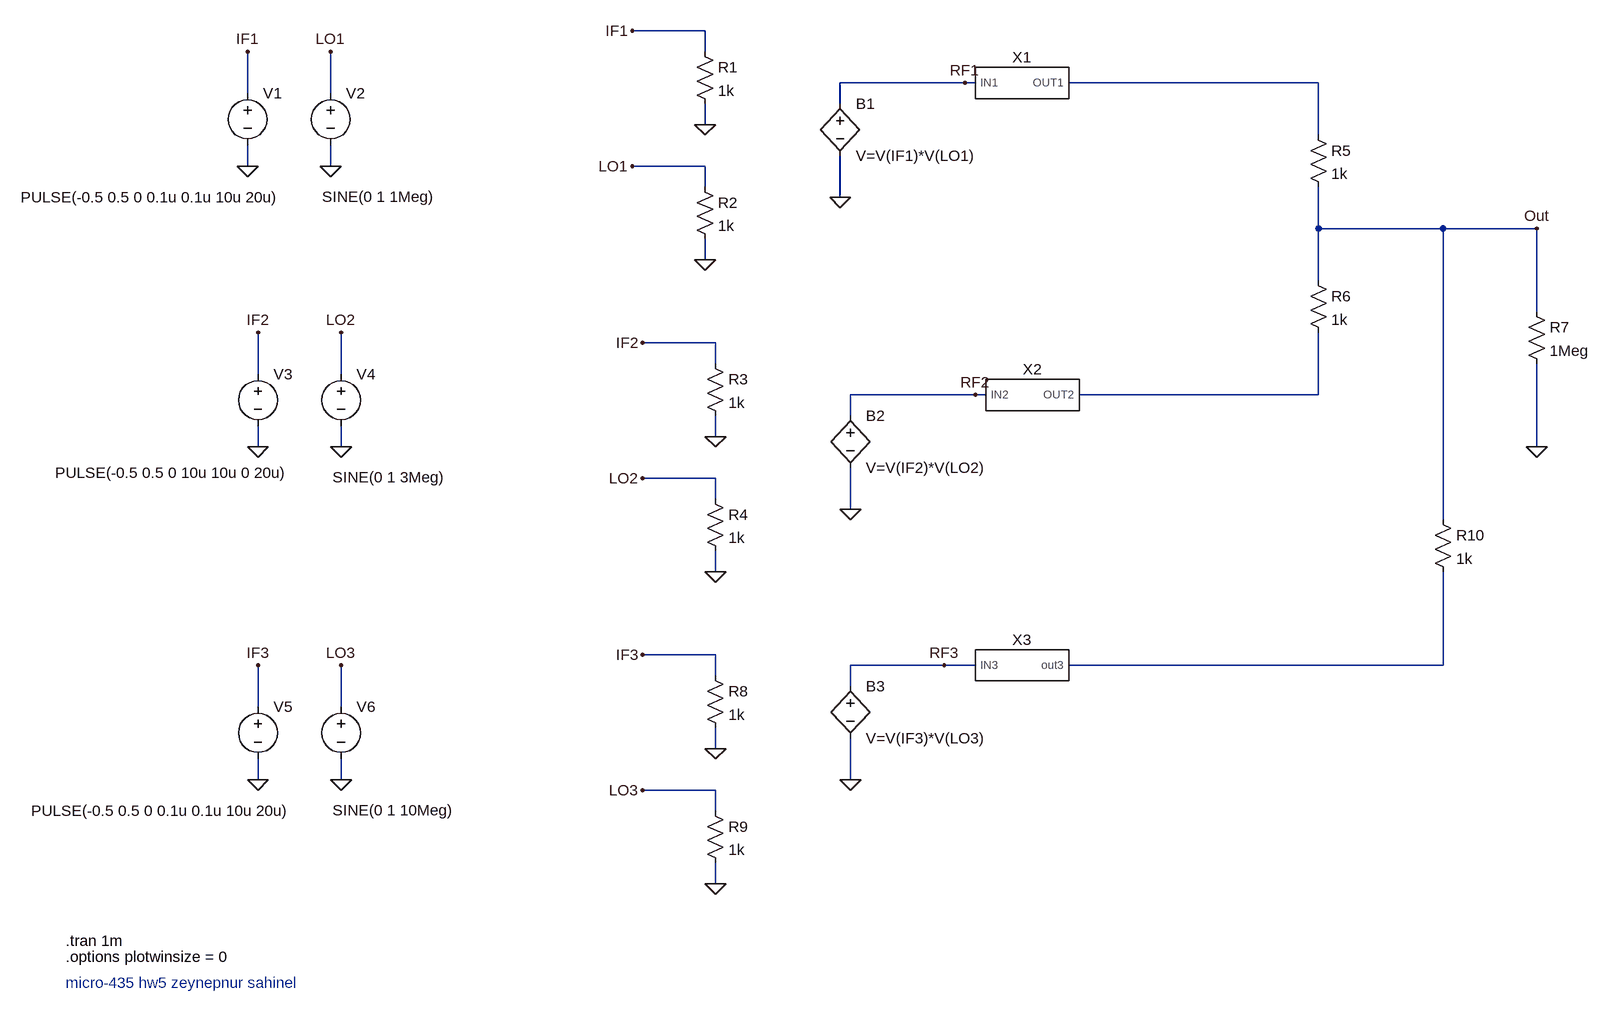
[diagram p0: schematic control3_wblocks.asc]
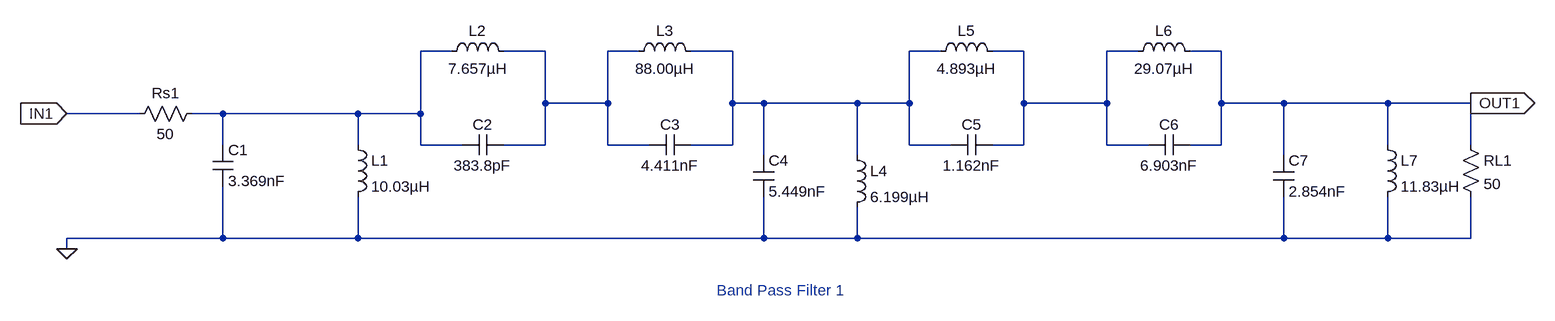
[diagram p1: sub-circuit bpf1.asc]
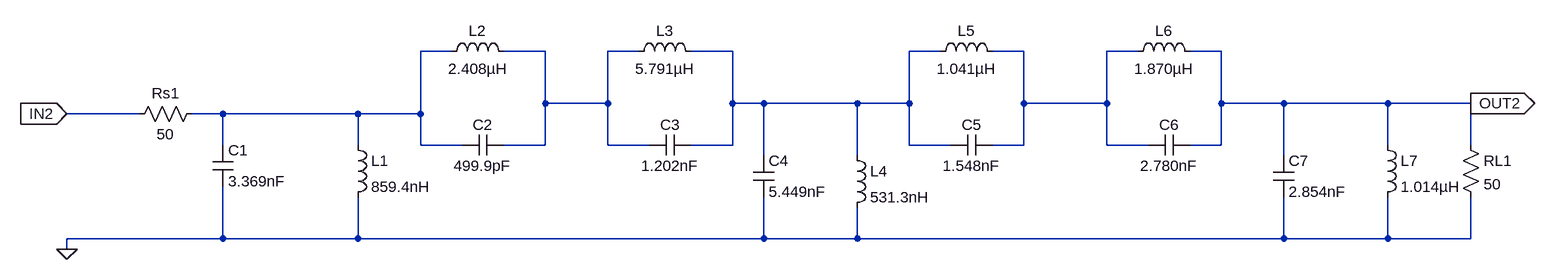
[diagram p2: sub-circuit bpf2.asc]
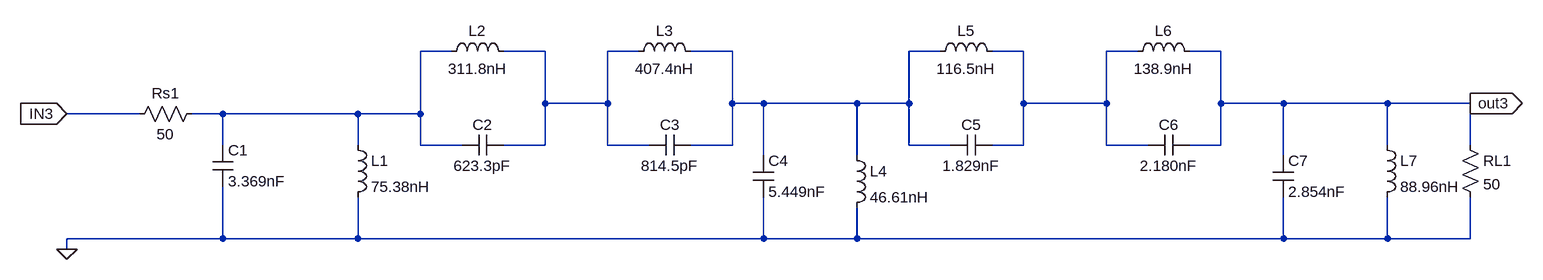
[diagram p3: sub-circuit bpf3.asc]
control3_wblocks.asc, the LTspice schematic file:
Version 4
SHEET 1 2360 840
WIRE -1328 -640 -1440 -640
WIRE -1328 -608 -1328 -640
WIRE -928 -560 -1120 -560
WIRE -912 -560 -928 -560
WIRE -384 -560 -768 -560
WIRE -2032 -544 -2032 -608
WIRE -1904 -544 -1904 -608
WIRE -1120 -528 -1120 -560
WIRE -1328 -496 -1328 -528
WIRE -384 -480 -384 -560
WIRE -2032 -432 -2032 -464
WIRE -1904 -432 -1904 -464
WIRE -1328 -432 -1440 -432
WIRE -1328 -400 -1328 -432
WIRE -1120 -384 -1120 -448
WIRE -384 -336 -384 -400
WIRE -192 -336 -384 -336
WIRE -48 -336 -192 -336
WIRE -1328 -288 -1328 -320
WIRE -384 -256 -384 -336
WIRE -48 -208 -48 -336
WIRE -1312 -160 -1424 -160
WIRE -1312 -128 -1312 -160
WIRE -2016 -112 -2016 -176
WIRE -1888 -112 -1888 -176
WIRE -912 -80 -1104 -80
WIRE -896 -80 -912 -80
WIRE -384 -80 -384 -176
WIRE -384 -80 -752 -80
WIRE -1104 -48 -1104 -80
WIRE -1312 -16 -1312 -48
WIRE -2016 0 -2016 -32
WIRE -1888 0 -1888 -32
WIRE -48 0 -48 -128
WIRE -1312 48 -1424 48
WIRE -1312 80 -1312 48
WIRE -1104 96 -1104 32
WIRE -192 112 -192 -336
WIRE -1312 192 -1312 160
WIRE -1312 320 -1424 320
WIRE -960 336 -1104 336
WIRE -912 336 -960 336
WIRE -192 336 -192 192
WIRE -192 336 -768 336
WIRE -1312 352 -1312 320
WIRE -1104 368 -1104 336
WIRE -2016 400 -2016 336
WIRE -1888 400 -1888 336
WIRE -1312 464 -1312 432
WIRE -2016 512 -2016 480
WIRE -1888 512 -1888 480
WIRE -1104 512 -1104 448
WIRE -1312 528 -1424 528
WIRE -1312 560 -1312 528
WIRE -1312 672 -1312 640
FLAG -1328 -496 0
FLAG -1440 -640 IF1
FLAG -1328 -288 0
FLAG -1440 -432 LO1
FLAG -1120 -384 0
FLAG -928 -560 RF1
FLAG -2032 -432 0
FLAG -1904 -432 0
FLAG -2032 -608 IF1
FLAG -1904 -608 LO1
FLAG -1312 -16 0
FLAG -1424 -160 IF2
FLAG -1312 192 0
FLAG -1424 48 LO2
FLAG -1104 96 0
FLAG -912 -80 RF2
FLAG -2016 0 0
FLAG -1888 0 0
FLAG -2016 -176 IF2
FLAG -1888 -176 LO2
FLAG -48 0 0
FLAG -48 -336 Out
FLAG -1312 464 0
FLAG -1424 320 IF3
FLAG -1312 672 0
FLAG -1424 528 LO3
FLAG -1104 512 0
FLAG -960 336 RF3
FLAG -2016 512 0
FLAG -1888 512 0
FLAG -2016 336 IF3
FLAG -1888 336 LO3
SYMBOL bv -1120 -544 R0
SYMATTR InstName B1
SYMATTR Value V=V(IF1)*V(LO1)
SYMBOL res -1344 -624 R0
SYMATTR InstName R1
SYMATTR Value 1k
SYMBOL res -1344 -416 R0
SYMATTR InstName R2
SYMATTR Value 1k
SYMBOL voltage -2032 -560 R0
WINDOW 3 -349 176 Left 2
WINDOW 123 0 0 Left 0
WINDOW 39 0 0 Left 0
SYMATTR Value PULSE(-0.5 0.5 0 0.1u 0.1u 10u 20u)
SYMATTR InstName V1
SYMBOL voltage -1904 -560 R0
WINDOW 3 -13 175 Left 2
WINDOW 123 0 0 Left 0
WINDOW 39 0 0 Left 0
SYMATTR Value SINE(0 1 1Meg)
SYMATTR InstName V2
SYMBOL bv -1104 -64 R0
SYMATTR InstName B2
SYMATTR Value V=V(IF2)*V(LO2)
SYMBOL res -1328 -144 R0
SYMATTR InstName R3
SYMATTR Value 1k
SYMBOL res -1328 64 R0
SYMATTR InstName R4
SYMATTR Value 1k
SYMBOL voltage -2016 -128 R0
WINDOW 3 -312 168 Left 2
WINDOW 123 0 0 Left 0
WINDOW 39 0 0 Left 0
SYMATTR Value PULSE(-0.5 0.5 0 10u 10u 0 20u)
SYMATTR InstName V3
SYMBOL voltage -1888 -128 R0
WINDOW 3 -13 175 Left 2
WINDOW 123 0 0 Left 0
WINDOW 39 0 0 Left 0
SYMATTR Value SINE(0 1 3Meg)
SYMATTR InstName V4
SYMBOL res -400 -496 R0
SYMATTR InstName R5
SYMATTR Value 1k
SYMBOL res -400 -272 R0
SYMATTR InstName R6
SYMATTR Value 1k
SYMBOL res -64 -224 R0
SYMATTR InstName R7
SYMATTR Value 1Meg
SYMBOL bv -1104 352 R0
SYMATTR InstName B3
SYMATTR Value V=V(IF3)*V(LO3)
SYMBOL res -1328 336 R0
SYMATTR InstName R8
SYMATTR Value 1k
SYMBOL res -1328 544 R0
SYMATTR InstName R9
SYMATTR Value 1k
SYMBOL voltage -2016 384 R0
WINDOW 3 -349 176 Left 2
WINDOW 123 0 0 Left 0
WINDOW 39 0 0 Left 0
SYMATTR Value PULSE(-0.5 0.5 0 0.1u 0.1u 10u 20u)
SYMATTR InstName V5
SYMBOL voltage -1888 384 R0
WINDOW 3 -13 175 Left 2
WINDOW 123 0 0 Left 0
WINDOW 39 0 0 Left 0
SYMATTR Value SINE(0 1 10Meg)
SYMATTR InstName V6
SYMBOL res -208 96 R0
SYMATTR InstName R10
SYMATTR Value 1k
SYMBOL BPF1 -848 -560 R0
SYMATTR InstName X1
SYMBOL BPF2 -832 -80 R0
SYMATTR InstName X2
SYMBOL BPF3 -848 336 R0
SYMATTR InstName X3
TEXT -2312 824 Left 2 ;micro-435 hw5 zeynepnur sahinel
TEXT -2312 760 Left 2 !.tran 1m
TEXT -2312 784 Left 2 !.options plotwinsize = 0

bpf1.asc, the sub-circuit schematic file:
Version 4
SHEET 1 1212 680
WIRE -480 48 -528 48
WIRE -336 48 -400 48
WIRE -192 48 -240 48
WIRE -48 48 -112 48
WIRE 272 48 224 48
WIRE 400 48 352 48
WIRE 576 48 528 48
WIRE 704 48 656 48
WIRE -336 128 -336 48
WIRE -240 128 -240 48
WIRE -240 128 -336 128
WIRE -48 128 -48 48
WIRE 0 128 -48 128
WIRE 144 128 0 128
WIRE 224 128 224 48
WIRE 224 128 144 128
WIRE 400 128 400 48
WIRE 528 128 528 48
WIRE 528 128 400 128
WIRE 704 128 704 48
WIRE 800 128 704 128
WIRE 960 128 800 128
WIRE 1088 128 960 128
WIRE -960 144 -1072 144
WIRE -832 144 -880 144
WIRE -624 144 -832 144
WIRE -528 144 -528 48
WIRE -528 144 -624 144
WIRE -832 192 -832 144
WIRE -624 192 -624 144
WIRE -528 192 -528 144
WIRE -464 192 -528 192
WIRE -336 192 -336 128
WIRE -336 192 -400 192
WIRE -240 192 -240 128
WIRE -176 192 -240 192
WIRE -48 192 -48 128
WIRE -48 192 -112 192
WIRE 224 192 224 128
WIRE 288 192 224 192
WIRE 400 192 400 128
WIRE 400 192 352 192
WIRE 528 192 528 128
WIRE 592 192 528 192
WIRE 704 192 704 128
WIRE 704 192 656 192
WIRE 960 192 960 128
WIRE 1088 192 1088 128
WIRE 0 208 0 128
WIRE 144 208 144 128
WIRE 800 208 800 128
WIRE -832 336 -832 256
WIRE -832 336 -1072 336
WIRE -624 336 -624 272
WIRE -624 336 -832 336
WIRE 0 336 0 272
WIRE 0 336 -624 336
WIRE 144 336 144 288
WIRE 144 336 0 336
WIRE 800 336 800 272
WIRE 800 336 144 336
WIRE 960 336 960 272
WIRE 960 336 800 336
WIRE 1088 336 1088 272
WIRE 1088 336 960 336
WIRE -1072 352 -1072 336
FLAG -1072 352 0
FLAG 1088 128 OUT1
IOPIN 1088 128 Out
FLAG -1072 144 IN1
IOPIN -1072 144 In
SYMBOL res -864 128 R90
WINDOW 0 0 56 VBottom 2
WINDOW 3 32 56 VTop 2
SYMATTR InstName Rs1
SYMATTR Value 50
SYMBOL cap -848 192 R0
SYMATTR InstName C1
SYMATTR Value 3.369nF
SYMBOL ind -640 176 R0
SYMATTR InstName L1
SYMATTR Value 10.03µH
SYMBOL ind -496 64 R270
WINDOW 0 32 56 VTop 2
WINDOW 3 5 56 VBottom 2
SYMATTR InstName L2
SYMATTR Value 7.657µH
SYMBOL cap -400 176 R90
WINDOW 0 0 32 VBottom 2
WINDOW 3 32 32 VTop 2
SYMATTR InstName C2
SYMATTR Value 383.8pF
SYMBOL ind -208 64 R270
WINDOW 0 32 56 VTop 2
WINDOW 3 5 56 VBottom 2
SYMATTR InstName L3
SYMATTR Value 88.00µH
SYMBOL cap -176 208 R270
WINDOW 0 32 32 VTop 2
WINDOW 3 0 32 VBottom 2
SYMATTR InstName C3
SYMATTR Value 4.411nF
SYMBOL cap -16 208 R0
SYMATTR InstName C4
SYMATTR Value 5.449nF
SYMBOL ind 128 192 R0
SYMATTR InstName L4
SYMATTR Value 6.199µH
SYMBOL ind 256 64 R270
WINDOW 0 32 56 VTop 2
WINDOW 3 5 56 VBottom 2
SYMATTR InstName L5
SYMATTR Value 4.893µH
SYMBOL cap 352 176 R90
WINDOW 0 0 32 VBottom 2
WINDOW 3 32 32 VTop 2
SYMATTR InstName C5
SYMATTR Value 1.162nF
SYMBOL ind 560 64 R270
WINDOW 0 32 56 VTop 2
WINDOW 3 5 56 VBottom 2
SYMATTR InstName L6
SYMATTR Value 29.07µH
SYMBOL cap 592 208 R270
WINDOW 0 32 32 VTop 2
WINDOW 3 0 32 VBottom 2
SYMATTR InstName C6
SYMATTR Value 6.903nF
SYMBOL cap 784 208 R0
SYMATTR InstName C7
SYMATTR Value 2.854nF
SYMBOL ind 944 176 R0
SYMATTR InstName L7
SYMATTR Value 11.83µH
SYMBOL res 1072 176 R0
SYMATTR InstName RL1
SYMATTR Value 50
TEXT -72 416 Left 2 ;Band Pass Filter 1

bpf2.asc, the sub-circuit schematic file:
Version 4
SHEET 1 1388 680
WIRE -304 -48 -352 -48
WIRE -160 -48 -224 -48
WIRE -16 -48 -64 -48
WIRE 128 -48 64 -48
WIRE 448 -48 400 -48
WIRE 576 -48 528 -48
WIRE 752 -48 704 -48
WIRE 880 -48 832 -48
WIRE -160 32 -160 -48
WIRE -64 32 -64 -48
WIRE -64 32 -160 32
WIRE 128 32 128 -48
WIRE 176 32 128 32
WIRE 320 32 176 32
WIRE 400 32 400 -48
WIRE 400 32 320 32
WIRE 576 32 576 -48
WIRE 704 32 704 -48
WIRE 704 32 576 32
WIRE 880 32 880 -48
WIRE 976 32 880 32
WIRE 1136 32 976 32
WIRE 1264 32 1136 32
WIRE -784 48 -896 48
WIRE -656 48 -704 48
WIRE -448 48 -656 48
WIRE -352 48 -352 -48
WIRE -352 48 -448 48
WIRE -656 96 -656 48
WIRE -448 96 -448 48
WIRE -352 96 -352 48
WIRE -288 96 -352 96
WIRE -160 96 -160 32
WIRE -160 96 -224 96
WIRE -64 96 -64 32
WIRE 0 96 -64 96
WIRE 128 96 128 32
WIRE 128 96 64 96
WIRE 400 96 400 32
WIRE 464 96 400 96
WIRE 576 96 576 32
WIRE 576 96 528 96
WIRE 704 96 704 32
WIRE 768 96 704 96
WIRE 880 96 880 32
WIRE 880 96 832 96
WIRE 1136 96 1136 32
WIRE 1264 96 1264 32
WIRE 176 112 176 32
WIRE 320 112 320 32
WIRE 976 112 976 32
WIRE -656 240 -656 160
WIRE -656 240 -896 240
WIRE -448 240 -448 176
WIRE -448 240 -656 240
WIRE 176 240 176 176
WIRE 176 240 -448 240
WIRE 320 240 320 192
WIRE 320 240 176 240
WIRE 976 240 976 176
WIRE 976 240 320 240
WIRE 1136 240 1136 176
WIRE 1136 240 976 240
WIRE 1264 240 1264 176
WIRE 1264 240 1136 240
WIRE -896 256 -896 240
FLAG -896 256 0
FLAG 1264 32 OUT2
IOPIN 1264 32 Out
FLAG -896 48 IN2
IOPIN -896 48 In
SYMBOL res -688 32 R90
WINDOW 0 0 56 VBottom 2
WINDOW 3 32 56 VTop 2
SYMATTR InstName Rs1
SYMATTR Value 50
SYMBOL cap -672 96 R0
SYMATTR InstName C1
SYMATTR Value 3.369nF
SYMBOL ind -464 80 R0
SYMATTR InstName L1
SYMATTR Value 859.4nH
SYMBOL ind -320 -32 R270
WINDOW 0 32 56 VTop 2
WINDOW 3 5 56 VBottom 2
SYMATTR InstName L2
SYMATTR Value 2.408µH
SYMBOL cap -224 80 R90
WINDOW 0 0 32 VBottom 2
WINDOW 3 32 32 VTop 2
SYMATTR InstName C2
SYMATTR Value 499.9pF
SYMBOL ind -32 -32 R270
WINDOW 0 32 56 VTop 2
WINDOW 3 5 56 VBottom 2
SYMATTR InstName L3
SYMATTR Value 5.791µH
SYMBOL cap 0 112 R270
WINDOW 0 32 32 VTop 2
WINDOW 3 0 32 VBottom 2
SYMATTR InstName C3
SYMATTR Value 1.202nF
SYMBOL cap 160 112 R0
SYMATTR InstName C4
SYMATTR Value 5.449nF
SYMBOL ind 304 96 R0
SYMATTR InstName L4
SYMATTR Value 531.3nH
SYMBOL ind 432 -32 R270
WINDOW 0 32 56 VTop 2
WINDOW 3 5 56 VBottom 2
SYMATTR InstName L5
SYMATTR Value 1.041µH
SYMBOL cap 528 80 R90
WINDOW 0 0 32 VBottom 2
WINDOW 3 32 32 VTop 2
SYMATTR InstName C5
SYMATTR Value 1.548nF
SYMBOL ind 736 -32 R270
WINDOW 0 32 56 VTop 2
WINDOW 3 5 56 VBottom 2
SYMATTR InstName L6
SYMATTR Value 1.870µH
SYMBOL cap 768 112 R270
WINDOW 0 32 32 VTop 2
WINDOW 3 0 32 VBottom 2
SYMATTR InstName C6
SYMATTR Value 2.780nF
SYMBOL cap 960 112 R0
SYMATTR InstName C7
SYMATTR Value 2.854nF
SYMBOL ind 1120 80 R0
SYMATTR InstName L7
SYMATTR Value 1.014µH
SYMBOL res 1248 80 R0
SYMATTR InstName RL1
SYMATTR Value 50

bpf3.asc, the sub-circuit schematic file:
Version 4
SHEET 1 1328 680
WIRE -352 32 -400 32
WIRE -208 32 -272 32
WIRE -64 32 -112 32
WIRE 80 32 16 32
WIRE 400 32 352 32
WIRE 528 32 480 32
WIRE 704 32 656 32
WIRE 832 32 784 32
WIRE -208 112 -208 32
WIRE -112 112 -112 32
WIRE -112 112 -208 112
WIRE 80 112 80 32
WIRE 128 112 80 112
WIRE 272 112 128 112
WIRE 352 112 352 32
WIRE 352 112 272 112
WIRE 528 112 528 32
WIRE 656 112 656 32
WIRE 656 112 528 112
WIRE 832 112 832 32
WIRE 928 112 832 112
WIRE 1088 112 928 112
WIRE 1216 112 1088 112
WIRE -832 128 -944 128
WIRE -704 128 -752 128
WIRE -496 128 -704 128
WIRE -400 128 -400 32
WIRE -400 128 -496 128
WIRE -704 176 -704 128
WIRE -496 176 -496 128
WIRE -400 176 -400 128
WIRE -336 176 -400 176
WIRE -208 176 -208 112
WIRE -208 176 -272 176
WIRE -112 176 -112 112
WIRE -48 176 -112 176
WIRE 80 176 80 112
WIRE 80 176 16 176
WIRE 352 176 352 112
WIRE 416 176 352 176
WIRE 528 176 528 112
WIRE 528 176 480 176
WIRE 656 176 656 112
WIRE 720 176 656 176
WIRE 832 176 832 112
WIRE 832 176 784 176
WIRE 1088 176 1088 112
WIRE 1216 176 1216 112
WIRE 128 192 128 112
WIRE 272 192 272 112
WIRE 928 192 928 112
WIRE -704 320 -704 240
WIRE -704 320 -944 320
WIRE -496 320 -496 256
WIRE -496 320 -704 320
WIRE 128 320 128 256
WIRE 128 320 -496 320
WIRE 272 320 272 272
WIRE 272 320 128 320
WIRE 928 320 928 256
WIRE 928 320 272 320
WIRE 1088 320 1088 256
WIRE 1088 320 928 320
WIRE 1216 320 1216 256
WIRE 1216 320 1088 320
WIRE -944 336 -944 320
FLAG -944 336 0
FLAG 1216 112 out3
IOPIN 1216 112 Out
FLAG -944 128 IN3
IOPIN -944 128 In
SYMBOL res -736 112 R90
WINDOW 0 0 56 VBottom 2
WINDOW 3 32 56 VTop 2
SYMATTR InstName Rs1
SYMATTR Value 50
SYMBOL cap -720 176 R0
SYMATTR InstName C1
SYMATTR Value 3.369nF
SYMBOL ind -512 160 R0
SYMATTR InstName L1
SYMATTR Value 75.38nH
SYMBOL ind -368 48 R270
WINDOW 0 32 56 VTop 2
WINDOW 3 5 56 VBottom 2
SYMATTR InstName L2
SYMATTR Value 311.8nH
SYMBOL cap -272 160 R90
WINDOW 0 0 32 VBottom 2
WINDOW 3 32 32 VTop 2
SYMATTR InstName C2
SYMATTR Value 623.3pF
SYMBOL ind -80 48 R270
WINDOW 0 32 56 VTop 2
WINDOW 3 5 56 VBottom 2
SYMATTR InstName L3
SYMATTR Value 407.4nH
SYMBOL cap -48 192 R270
WINDOW 0 32 32 VTop 2
WINDOW 3 0 32 VBottom 2
SYMATTR InstName C3
SYMATTR Value 814.5pF
SYMBOL cap 112 192 R0
SYMATTR InstName C4
SYMATTR Value 5.449nF
SYMBOL ind 256 176 R0
SYMATTR InstName L4
SYMATTR Value 46.61nH
SYMBOL ind 384 48 R270
WINDOW 0 32 56 VTop 2
WINDOW 3 5 56 VBottom 2
SYMATTR InstName L5
SYMATTR Value 116.5nH
SYMBOL cap 480 160 R90
WINDOW 0 0 32 VBottom 2
WINDOW 3 32 32 VTop 2
SYMATTR InstName C5
SYMATTR Value 1.829nF
SYMBOL ind 688 48 R270
WINDOW 0 32 56 VTop 2
WINDOW 3 5 56 VBottom 2
SYMATTR InstName L6
SYMATTR Value 138.9nH
SYMBOL cap 720 192 R270
WINDOW 0 32 32 VTop 2
WINDOW 3 0 32 VBottom 2
SYMATTR InstName C6
SYMATTR Value 2.180nF
SYMBOL cap 912 192 R0
SYMATTR InstName C7
SYMATTR Value 2.854nF
SYMBOL ind 1072 160 R0
SYMATTR InstName L7
SYMATTR Value 88.96nH
SYMBOL res 1200 160 R0
SYMATTR InstName RL1
SYMATTR Value 50

The netlist it stands for:
* control3_wblocks.asc
B1 RF1 0 V=V(IF1)*V(LO1)
R1 IF1 0 1k
R2 LO1 0 1k
V1 IF1 0 PULSE(-0.5 0.5 0 0.1u 0.1u 10u 20u)
V2 LO1 0 SINE(0 1 1Meg)
B2 RF2 0 V=V(IF2)*V(LO2)
R3 IF2 0 1k
R4 LO2 0 1k
V3 IF2 0 PULSE(-0.5 0.5 0 10u 10u 0 20u)
V4 LO2 0 SINE(0 1 3Meg)
R5 N001 Out 1k
R6 Out N002 1k
R7 Out 0 1Meg
B3 RF3 0 V=V(IF3)*V(LO3)
R8 IF3 0 1k
R9 LO3 0 1k
V5 IF3 0 PULSE(-0.5 0.5 0 0.1u 0.1u 10u 20u)
V6 LO3 0 SINE(0 1 10Meg)
R10 Out N003 1k
XX1 RF1 N001 bpf1
XX2 RF2 N002 bpf2
XX3 RF3 N003 bpf3

* block symbol definitions
.subckt bpf1 IN1 OUT1
Rs1 N001 IN1 50
C1 N001 0 3.369nF
L1 N001 0 10.03µH
L2 N001 N002 7.657µH
C2 N002 N001 383.8pF
L3 N002 N003 88.00µH
C3 N002 N003 4.411nF
C4 N003 0 5.449nF
L4 N003 0 6.199µH
L5 N003 N004 4.893µH
C5 N004 N003 1.162nF
L6 N004 OUT1 29.07µH
C6 N004 OUT1 6.903nF
C7 OUT1 0 2.854nF
L7 OUT1 0 11.83µH
RL1 OUT1 0 50
* Band Pass Filter 1
.ends bpf1

.subckt bpf2 IN2 OUT2
Rs1 N001 IN2 50
C1 N001 0 3.369nF
L1 N001 0 859.4nH
L2 N001 N002 2.408µH
C2 N002 N001 499.9pF
L3 N002 N003 5.791µH
C3 N002 N003 1.202nF
C4 N003 0 5.449nF
L4 N003 0 531.3nH
L5 N003 N004 1.041µH
C5 N004 N003 1.548nF
L6 N004 OUT2 1.870µH
C6 N004 OUT2 2.780nF
C7 OUT2 0 2.854nF
L7 OUT2 0 1.014µH
RL1 OUT2 0 50
.ends bpf2

.subckt bpf3 IN3 out3
Rs1 N001 IN3 50
C1 N001 0 3.369nF
L1 N001 0 75.38nH
L2 N001 N002 311.8nH
C2 N002 N001 623.3pF
L3 N002 N003 407.4nH
C3 N002 N003 814.5pF
C4 N003 0 5.449nF
L4 N003 0 46.61nH
L5 N003 N004 116.5nH
C5 N004 N003 1.829nF
L6 N004 out3 138.9nH
C6 N004 out3 2.180nF
C7 out3 0 2.854nF
L7 out3 0 88.96nH
RL1 out3 0 50
.ends bpf3

* micro-435 hw5 zeynepnur sahinel
.tran 1m
.options plotwinsize = 0
.backanno
.end